# Altium schematic sheet I2C_Arbitration.SchDoc
size A; Organization: Altium Limited; Address1: L3, 12a Rodborough Rd; Address2: Frenchs Forest; Address3: NSW; Address4: Australia 2086; DocumentNumber: 3; SheetNumber: 3; SheetTotal: 3
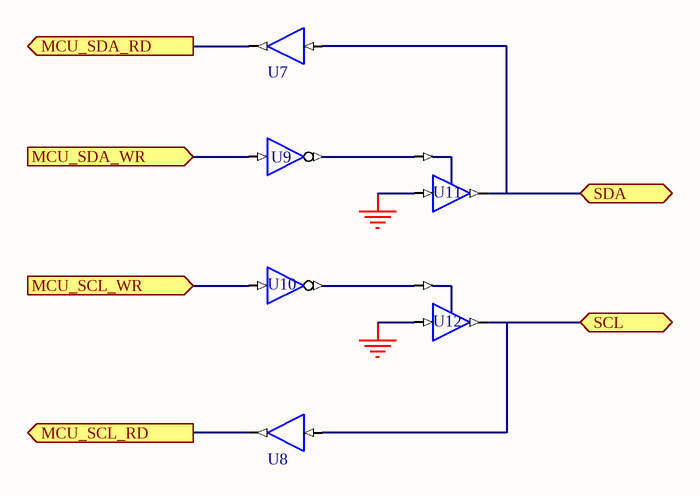
[diagram p0: I2C_Arbitration.SchDoc]

## Parts
U7  BUF  (value not drawn)
U8  BUF  (value not drawn)
U9  INV  (value not drawn)
U10  INV  (value not drawn)
U11  BUFE  (value not drawn)
U12  BUFE  (value not drawn)

## Ports
MCU_SCL_RD (out), MCU_SCL_WR (in), MCU_SDA_RD (out), MCU_SDA_WR (in), SCL (bidir), SDA (bidir)

## Nets
GND: U11.I U12.I
MCU_SCL_RD: U8.O ; port MCU_SCL_RD
MCU_SCL_WR: U10.I ; port MCU_SCL_WR
MCU_SDA_RD: U7.O ; port MCU_SDA_RD
MCU_SDA_WR: U9.I ; port MCU_SDA_WR
SCL: U8.I U12.O ; port SCL
SDA: U7.I U11.O ; port SDA
NetU9_O: U9.O U11.E
NetU10_O: U10.O U12.E

## Notes on the sheet
- Title
- Size:
- Date:
- A
- Number:
- Time:
- Revision:
- Sheet
- of
- File:

## Library data of the parts
U7 U8 = BUF: 1-bit General Purpose (Non-inverting) Buffer; ArchiveName: GENERIC; Published: 18-Nov-2003; Publisher: Altium Limited; Xilinx Equivalent: BUF; Core Revision: 1.00.00
U9 U10 = INV: Inverter; ArchiveName: GENERIC; Published: 18-Nov-2003; Publisher: Altium Limited; Xilinx Equivalent: INV; Core Revision: 1.00.00
U11 U12 = BUFE: 1-bit 3-state Buffer with Active High Enable; ArchiveName: GENERIC; Published: 18-Nov-2003; Publisher: Altium Limited; Xilinx Equivalent: BUFE; Core Revision: 1.00.00